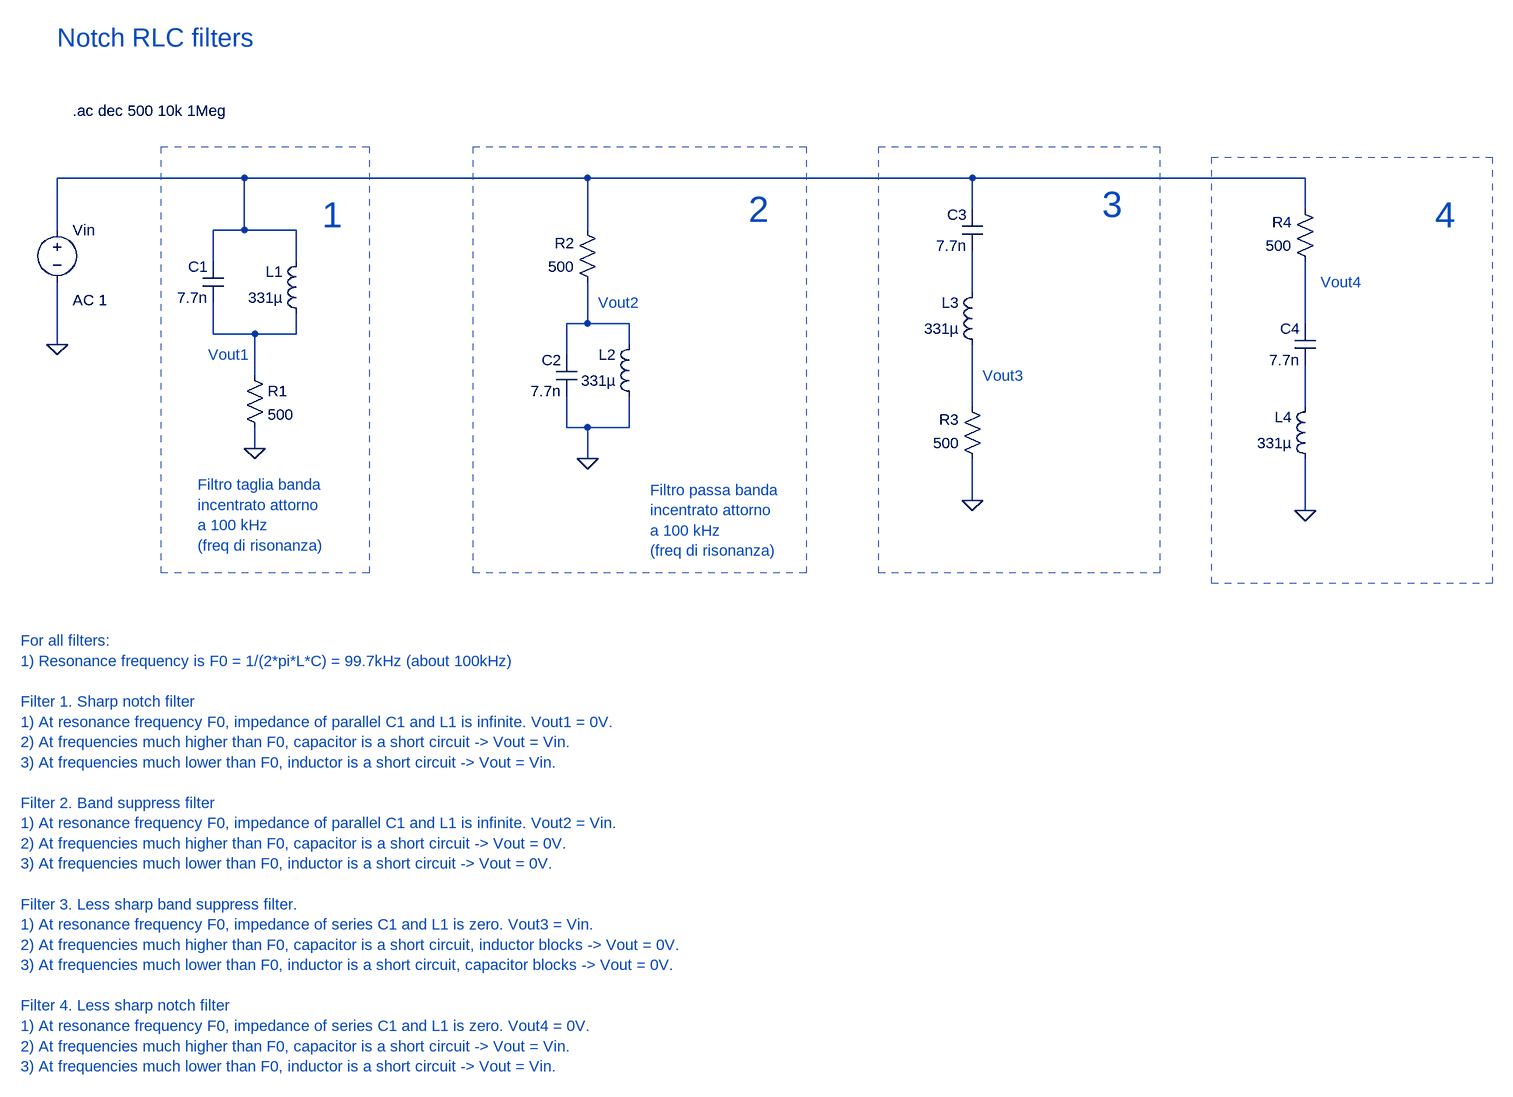
[diagram p0: schematic Notch-and-band-suppress-filters.asc]
Notch-and-band-suppress-filters.asc, the LTspice schematic file:
Version 4
SHEET 1 1540 1300
WIRE -384 -16 -672 -16
WIRE 144 -16 -384 -16
WIRE 736 -16 144 -16
WIRE 1248 -16 736 -16
WIRE 736 32 736 -16
WIRE 1248 32 1248 -16
WIRE -672 64 -672 -16
WIRE -384 64 -384 -16
WIRE -384 64 -432 64
WIRE -304 64 -384 64
WIRE 144 64 144 -16
WIRE -432 112 -432 64
WIRE -304 112 -304 64
WIRE 736 160 736 96
WIRE 144 208 144 144
WIRE 144 208 112 208
WIRE 208 208 144 208
WIRE 1248 208 1248 112
WIRE -432 224 -432 176
WIRE -368 224 -432 224
WIRE -304 224 -304 192
WIRE -304 224 -368 224
WIRE -672 240 -672 144
WIRE 208 240 208 208
WIRE 112 256 112 208
WIRE -368 288 -368 224
WIRE 736 336 736 240
WIRE 1248 336 1248 272
WIRE 112 368 112 320
WIRE 144 368 112 368
WIRE 208 368 208 320
WIRE 208 368 144 368
WIRE -368 400 -368 368
WIRE 144 416 144 368
WIRE 736 480 736 416
WIRE 1248 496 1248 416
FLAG -368 400 0
FLAG -672 240 0
FLAG 144 416 0
FLAG 736 480 0
FLAG 1248 496 0
SYMBOL ind -288 208 R180
WINDOW 0 36 80 Left 2
WINDOW 3 36 40 Left 2
SYMATTR InstName L1
SYMATTR Value 331µ
SYMBOL cap -416 176 R180
WINDOW 0 24 56 Left 2
WINDOW 3 24 8 Left 2
SYMATTR InstName C1
SYMATTR Value 7.7n
SYMBOL res -384 272 R0
SYMATTR InstName R1
SYMATTR Value 500
SYMBOL voltage -672 48 R0
WINDOW 123 24 124 Left 2
WINDOW 39 0 0 Left 2
SYMATTR Value2 AC 1
SYMATTR InstName Vin
SYMATTR Value ""
SYMBOL ind 224 336 R180
WINDOW 0 36 80 Left 2
WINDOW 3 36 40 Left 2
SYMATTR InstName L2
SYMATTR Value 331µ
SYMBOL cap 128 320 R180
WINDOW 0 24 56 Left 2
WINDOW 3 24 8 Left 2
SYMATTR InstName C2
SYMATTR Value 7.7n
SYMBOL res 160 160 R180
WINDOW 0 36 76 Left 2
WINDOW 3 36 40 Left 2
SYMATTR InstName R2
SYMATTR Value 500
SYMBOL cap 752 96 R180
WINDOW 0 24 56 Left 2
WINDOW 3 24 8 Left 2
SYMATTR InstName C3
SYMATTR Value 7.7n
SYMBOL ind 752 256 R180
WINDOW 0 36 80 Left 2
WINDOW 3 36 40 Left 2
SYMATTR InstName L3
SYMATTR Value 331µ
SYMBOL res 752 432 R180
WINDOW 0 36 76 Left 2
WINDOW 3 36 40 Left 2
SYMATTR InstName R3
SYMATTR Value 500
SYMBOL cap 1264 272 R180
WINDOW 0 24 56 Left 2
WINDOW 3 24 8 Left 2
SYMATTR InstName C4
SYMATTR Value 7.7n
SYMBOL ind 1264 432 R180
WINDOW 0 36 80 Left 2
WINDOW 3 36 40 Left 2
SYMATTR InstName L4
SYMATTR Value 331µ
SYMBOL res 1264 128 R180
WINDOW 0 36 76 Left 2
WINDOW 3 36 40 Left 2
SYMATTR InstName R4
SYMATTR Value 500
TEXT -648 -120 Left 2 !.ac dec 500 10k 1Meg
TEXT 240 464 Left 2 ;Filtro passa banda \nincentrato attorno \na 100 kHz \n(freq di risonanza)
TEXT -456 456 Left 2 ;Filtro taglia banda \nincentrato attorno \na 100 kHz \n(freq di risonanza)
TEXT -440 256 Left 2 ;Vout1
TEXT 160 176 Left 2 ;Vout2
TEXT -672 -232 Left 4 ;Notch RLC filters
TEXT -264 40 Left 5 ;1
TEXT 392 32 Left 5 ;2
TEXT -728 696 Left 2 ;For all filters:\n1) Resonance frequency is F0 = 1/(2*pi*L*C) = 99.7kHz (about 100kHz)\n \nFilter 1. Sharp notch filter\n1) At resonance frequency F0, impedance of parallel C1 and L1 is infinite. Vout1 = 0V.\n2) At frequencies much higher than F0, capacitor is a short circuit -> Vout = Vin.\n3) At frequencies much lower than F0, inductor is a short circuit -> Vout = Vin.\n \nFilter 2. Band suppress filter\n1) At resonance frequency F0, impedance of parallel C1 and L1 is infinite. Vout2 = Vin.\n2) At frequencies much higher than F0, capacitor is a short circuit -> Vout = 0V.\n3) At frequencies much lower than F0, inductor is a short circuit -> Vout = 0V.\n \nFilter 3. Less sharp band suppress filter.\n1) At resonance frequency F0, impedance of series C1 and L1 is zero. Vout3 = Vin.\n2) At frequencies much higher than F0, capacitor is a short circuit, inductor blocks -> Vout = 0V.\n3) At frequencies much lower than F0, inductor is a short circuit, capacitor blocks -> Vout = 0V.\n \nFilter 4. Less sharp notch filter\n1) At resonance frequency F0, impedance of series C1 and L1 is zero. Vout4 = 0V.\n2) At frequencies much higher than F0, capacitor is a short circuit -> Vout = Vin.\n3) At frequencies much lower than F0, inductor is a short circuit -> Vout = Vin.
TEXT 936 24 Left 5 ;3
TEXT 1448 40 Left 5 ;4
TEXT 752 288 Left 2 ;Vout3
TEXT 1272 144 Left 2 ;Vout4
RECTANGLE Normal -192 592 -512 -64 2
RECTANGLE Normal 480 592 -32 -64 2
RECTANGLE Normal 1024 592 592 -64 2
RECTANGLE Normal 1536 608 1104 -48 2

The netlist it stands for:
* Notch-and-band-suppress-filters.asc
L1 N005 N001 331µ
C1 N005 N001 7.7n
R1 N005 0 500
Vin N001 0 AC 1
L2 0 N003 331µ
C2 0 N003 7.7n
R2 N003 N001 500
C3 N002 N001 7.7n
L3 N006 N002 331µ
R3 0 N006 500
C4 N007 N004 7.7n
L4 0 N007 331µ
R4 N004 N001 500
.ac dec 500 10k 1Meg
* Filtro passa banda
* incentrato attorno
* a 100 kHz
* (freq di risonanza)
* Filtro taglia banda
* incentrato attorno
* a 100 kHz
* (freq di risonanza)
* Vout1
* Vout2
* Notch RLC filters
* 1
* 2
* For all filters:
* 1) Resonance frequency is F0 = 1/(2*pi*L*C) = 99.7kHz (about 100kHz)
* Filter 1. Sharp notch filter
* 1) At resonance frequency F0, impedance of parallel C1 and L1 is infinite. Vout1 = 0V.
* 2) At frequencies much higher than F0, capacitor is a short circuit -> Vout = Vin.
* 3) At frequencies much lower than F0, inductor is a short circuit -> Vout = Vin.
* Filter 2. Band suppress filter
* 1) At resonance frequency F0, impedance of parallel C1 and L1 is infinite. Vout2 = Vin.
* 2) At frequencies much higher than F0, capacitor is a short circuit -> Vout = 0V.
* 3) At frequencies much lower than F0, inductor is a short circuit -> Vout = 0V.
* Filter 3. Less sharp band suppress filter.
* 1) At resonance frequency F0, impedance of series C1 and L1 is zero. Vout3 = Vin.
* 2) At frequencies much higher than F0, capacitor is a short circuit, inductor blocks -> Vout = 0V.
* 3) At frequencies much lower than F0, inductor is a short circuit, capacitor blocks -> Vout = 0V.
* Filter 4. Less sharp notch filter
* 1) At resonance frequency F0, impedance of series C1 and L1 is zero. Vout4 = 0V.
* 2) At frequencies much higher than F0, capacitor is a short circuit -> Vout = Vin.
* 3) At frequencies much lower than F0, inductor is a short circuit -> Vout = Vin.
* 3
* 4
* Vout3
* Vout4
.backanno
.end